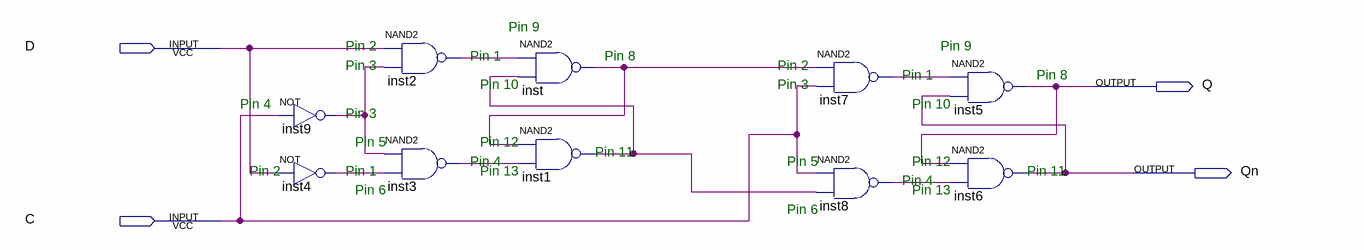
[diagram p0: schematic sheet]
// Quartus schematic d_flip_flop.bdf as structural Verilog: 10 symbols, 4 pins
module d_flip_flop (
  input  D,
  input  C,
  output Q,
  output Qn
);

  wire inst1_out, inst2_out, inst3_out, inst4_out, inst7_out, inst8_out, inst9_out, inst_out;

  not inst9 (inst9_out, C);
  not inst4 (inst4_out, D);
  nand inst2 (inst2_out, D, inst9_out);
  nand inst3 (inst3_out, inst9_out, inst4_out);
  nand inst (inst_out, inst2_out, inst1_out);
  nand inst1 (inst1_out, inst_out, inst3_out);
  nand inst7 (inst7_out, inst_out, C);
  nand inst8 (inst8_out, C, inst1_out);
  nand inst5 (Q, inst7_out, Qn);
  nand inst6 (Qn, Q, inst8_out);

  // Notes on the sheet:
  //   Pin 9
  //   Pin 2
  //   Pin 9
  //   Pin 1
  //   Pin 8
  //   Pin 3
  //   Pin 2
  //   Pin 1
  //   Pin 8
  //   Pin 10
  //   Pin 3
  //   Pin 4
  //   Pin 10
  //   Pin 3
  //   Pin 5
  //   Pin 12
  //   Pin 11
  //   Pin 4
  //   Pin 5
  //   Pin 12
  //   Pin 2
  //   Pin 1
  //   Pin 13
  //   Pin 11
  //   Pin 4
  //   Pin 6
  //   Pin 13
  //   Pin 6
endmodule
